# EAGLE schematic loadCell_Amplifier_v2.0 (EAGLE 8.0.0)
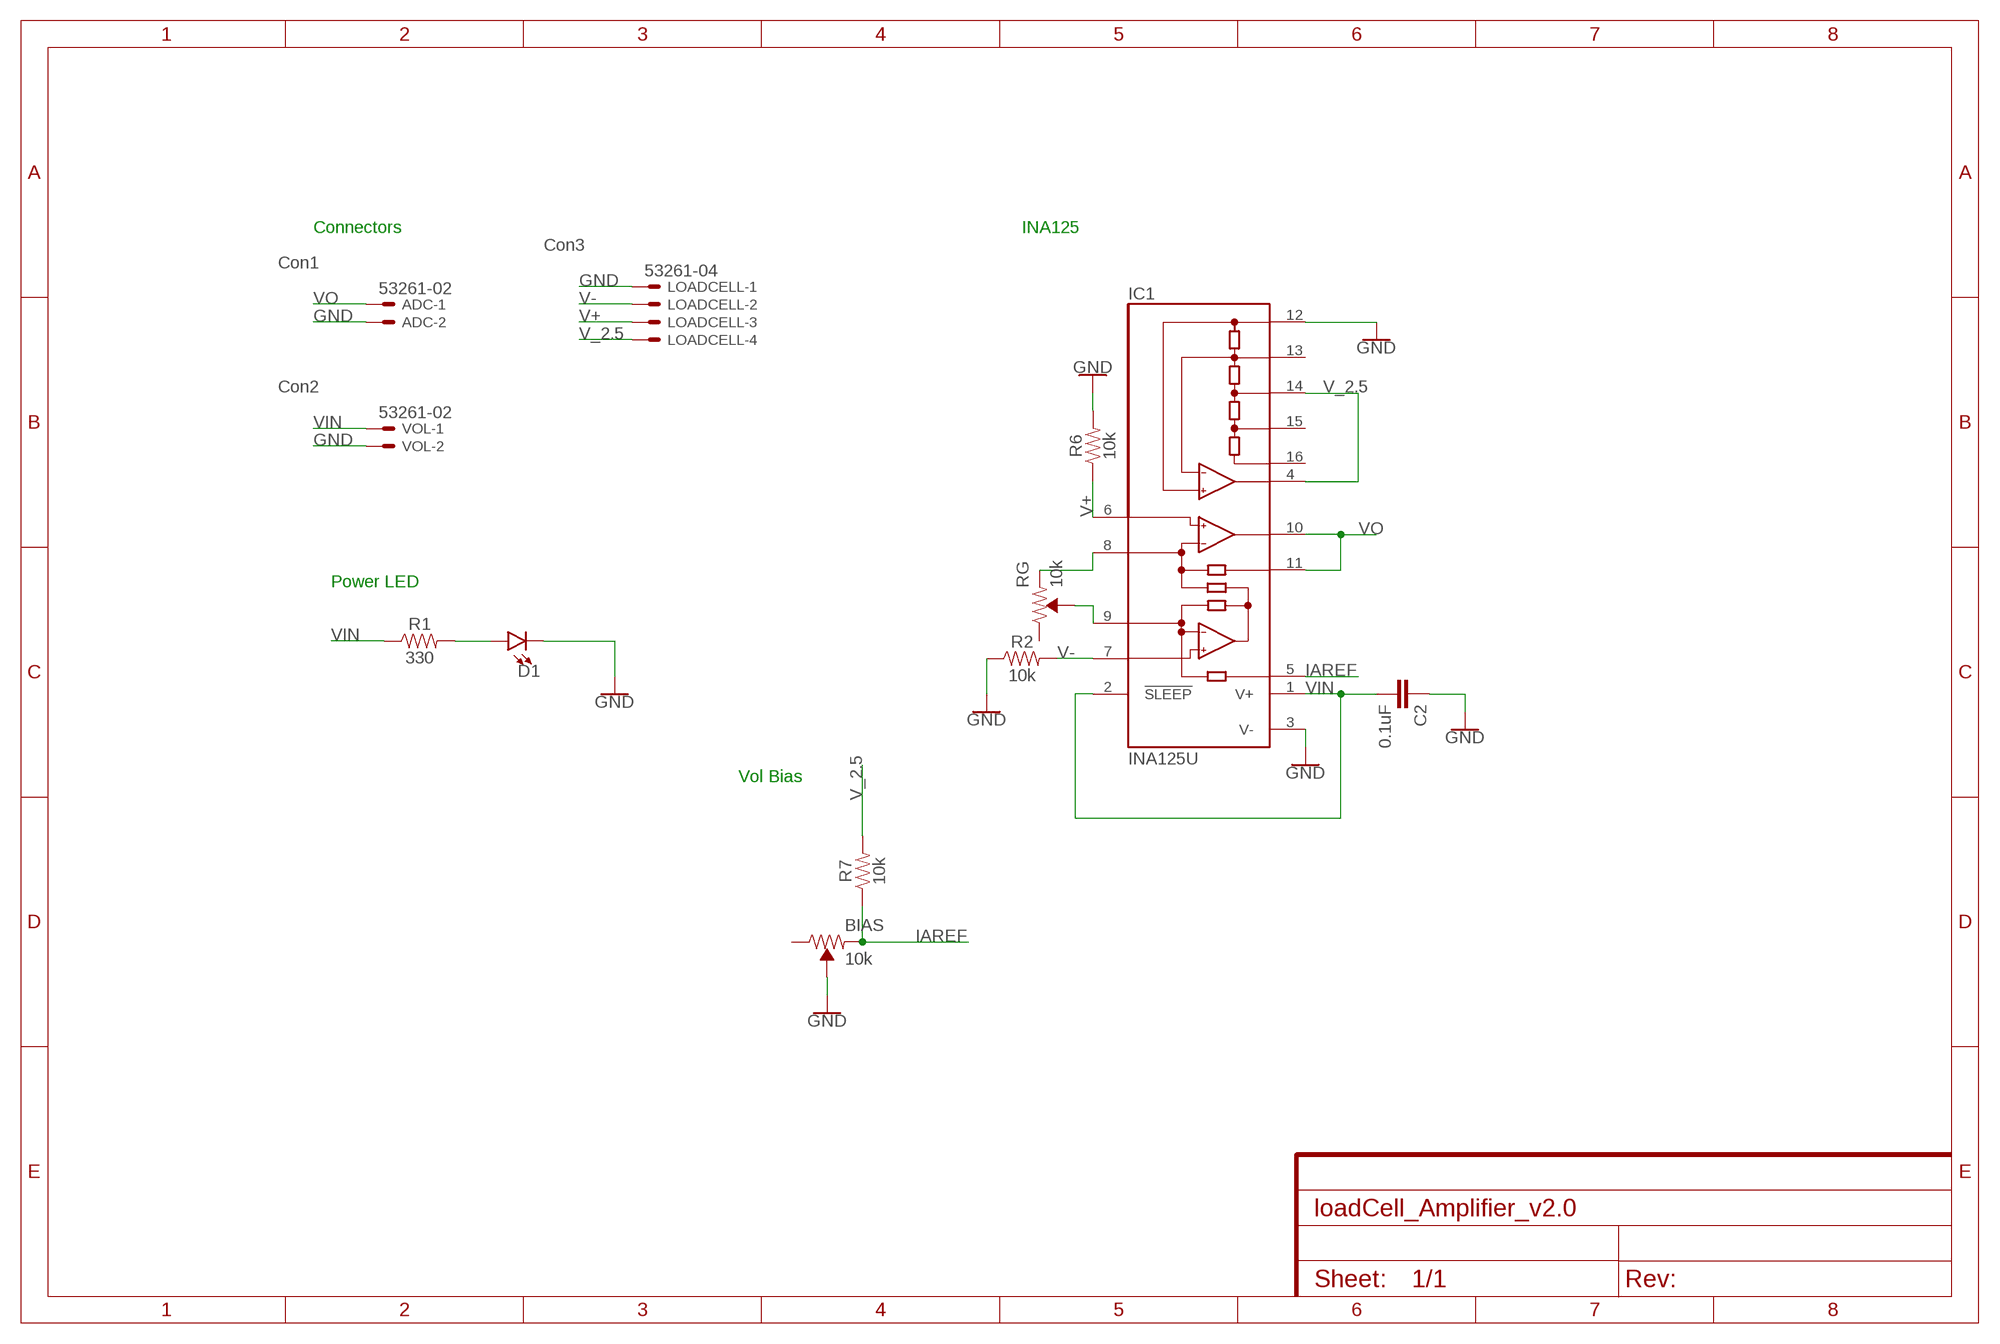
[diagram p0: schematic, sheet 1]

## Parts
ADC  53261-02  [53261-02]
BIAS  10k  TRIMPOT-PTH-10MM-KNOB-1/2W-10%  [TRIMPOT-PTH-3386U]
C2  0.1uF  0.1UF-KIT-EZ-50V-20%  [CAP-PTH-SMALL-KIT]
D1  LED0603  [LED-0603]
IC1  INA125U  [SO16-1]
LOADCELL  53261-04  [53261-04]
R1  330  0.05OHM-0603-1/5W-1%  [0603]
R2  10k  0.05OHM-0603-1/5W-1%  [0603]
R6  10k  0.05OHM-0603-1/5W-1%  [0603]
R7  10k  0.05OHM-0603-1/5W-1%  [0603]
RG  10k  TRIMPOT-PTH-10MM-KNOB-1/2W-10%  [TRIMPOT-PTH-3386U]
VOL  53261-02  [53261-02]

## Nets
GND: ADC.2 BIAS.2(WIPER) C2.1 D1.C IC1.3(V-) IC1.12(REFCOM) LOADCELL.1 R2.1 R6.2 VOL.2
IAREF: BIAS.1(CCW) IC1.5(REF) R7.1
N$3: IC1.8(RG) RG.1(CCW)
N$4: IC1.9(RG) RG.2(WIPER)
N$6: D1.A R1.2
V+: IC1.6(+IN) LOADCELL.3 R6.1
V-: IC1.7(-IN) LOADCELL.2 R2.2
V_2.5: IC1.4(REFOUT) IC1.14(REF2.5) LOADCELL.4 R7.2
VIN: C2.2 IC1.1(V+) IC1.2(!SLEEP) R1.1 VOL.1
VO: ADC.1 IC1.10(OUT) IC1.11(SENSE)
Unconnected: BIAS.3(CW) IC1.13(REFBG) IC1.15(REF5) IC1.16(REF10) RG.3(CW)

## Notes on the sheet
- Connectors | INA125
- Con3
- Con1
- Con2
- Power LED
- Vol Bias

## Library data of the parts
ADC VOL = con-molex:53?-02: CONNECTOR wire to board 1.25 mm (.049 inch) pitch header; OC_FARNELL: 1125373; OC_NEWARK: unknown
BIAS RG = SparkFun-Resistors:TRIMPOT: Trimming Potentiometer (Trimpot) Three-terminal potentiometers, with an adjustable wiper and two adjustable resistors. A pot can be used to create a configurable voltage divider, or as a variable resistor. "Trimpots" are a subset of potentiometers, usually intended for "set-and-forget" applications. They're often more delicate than standard potentiometers - rated for fewer turns. Variants PTH-KNOB - PTH Trimpot w/ finger-adjustable knob Trimpot 10K with Knob <https://www.sparkfun.com/products/9806> (COM-09806) Datasheet <http://www.sparkfun.com/datasheets/Components/General/TSR-3386.pdf> SMD-3MM-CLOSED-FRAME - SMD 3mm Square Closed-Frame Trimpot Used on e.g. EasyDriver - Stepper Motor Driver <https://www.sparkfun.com/products/12779> Datasheet <http://www.bitechnologies.com/pdfs/22.pdf> (22AR10KTR) SMD-5MM - SMD 5mm Square Closed-Frame Trimpot Used on e.g. IOIO-OTG - V2.2 <https://www.sparkfun.com/products/13613> Datasheet <http://www.vishay.com/docs/51008/ts53.pdf> (TS53YL502MR10) SMD-3MM-1/10W-25% - 3mm Square Open-Frame Trimpot Used on e.g. SparkFun Shapeoko <https://www.sparkfun.com/products/13899> Datasheet <http://www.bourns.com/docs/Product-Datasheets/TC33.pdf> (TC33X-2-103E); PROD_ID: RES-09730; SF_SKU: COM-09806
C2 = SparkFun-Capacitors:0.1UF: 0.1µF ceramic capacitors A capacitor is a passive two-terminal electrical component used to store electrical energy temporarily in an electric field.; PROD_ID: CAP-08370
D1 = SparkFun-LED:LED: LED (Generic) Standard schematic elements and footprints for 5mm, 3mm, 1206, and 0603 sized LEDs. Generic LEDs with no color specified.
IC1 = burr-brown:INA125: Instrumentation Amplifier with Precision Voltage Reference; MF: TEXAS INSTRUMENT CONNECTORS; MPN: INA125U; OC_FARNELL: 1304375; OC_NEWARK: 80K5901
LOADCELL = con-molex:53?-04: CONNECTOR wire to board 1.25 mm (.049 inch) pitch header; OC_FARNELL: 1125374; OC_NEWARK: unknown
R1 R2 R6 R7 = SparkFun-Resistors:0.05OHM: 0.05Ω resistor A resistor is a passive two-terminal electrical component that implements electrical resistance as a circuit element. Resistors act to reduce current flow, and, at the same time, act to lower voltage levels within circuits. - Wikipedia; PROD_ID: RES-12535; VALUE: 0.05